# Altium schematic sheet Power.SchDoc
size A4; SheetNumber: 6; SheetTotal: 6
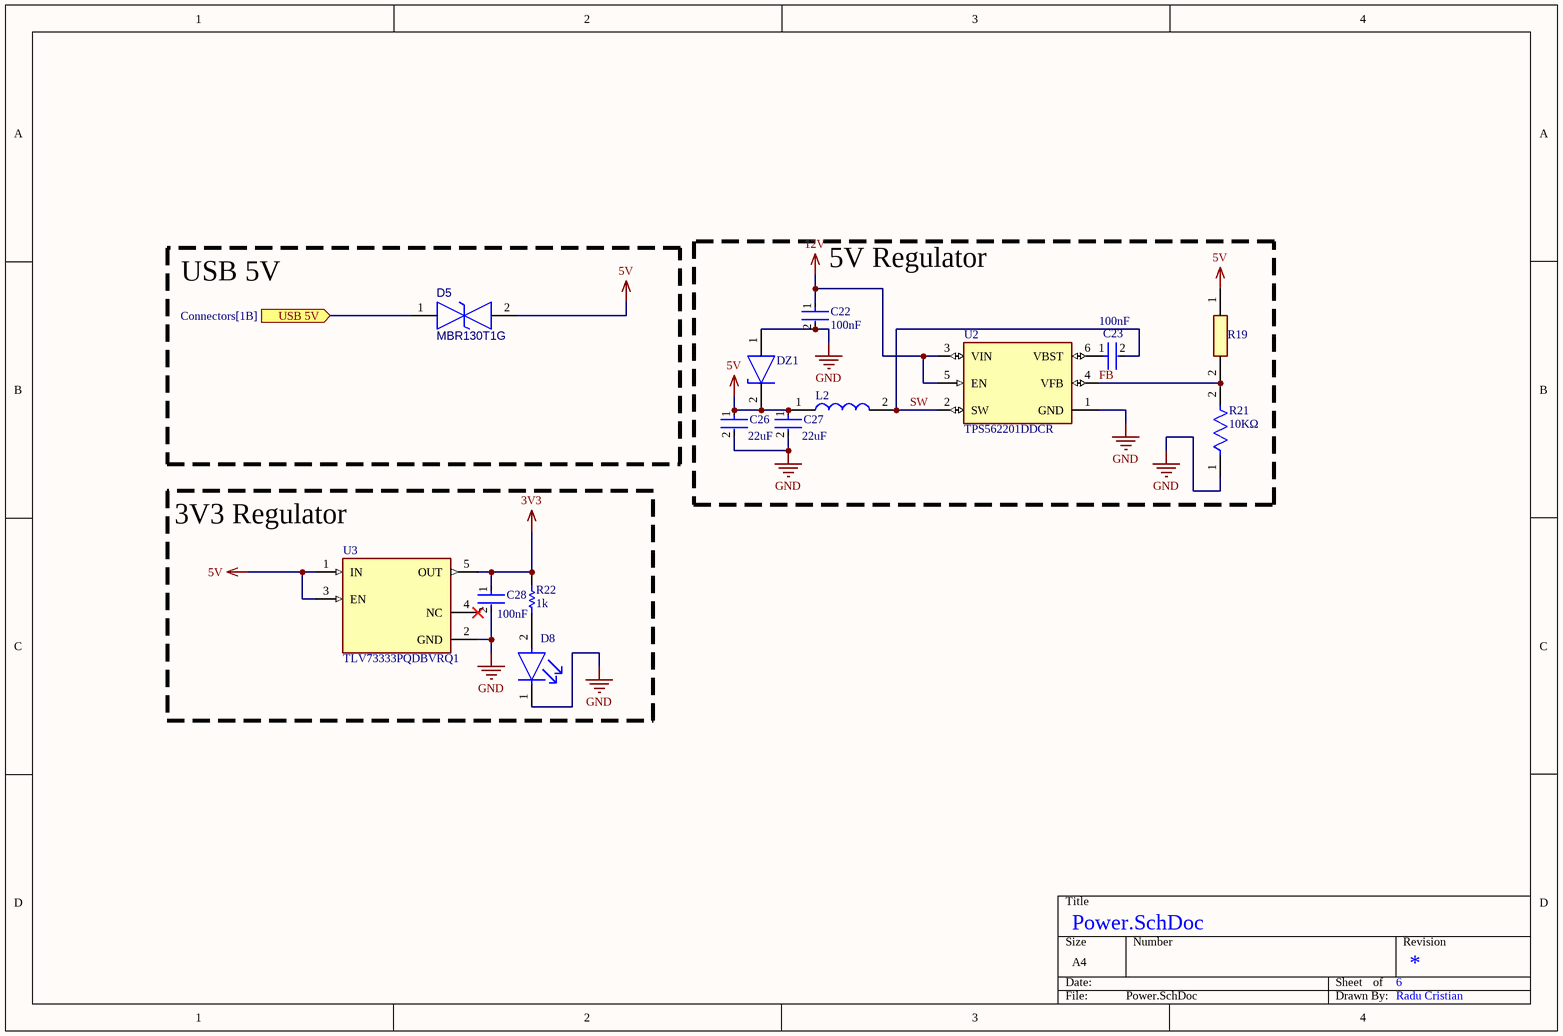
[diagram p0: Power.SchDoc]

## Parts
C22  Capacitance: 100nF  [FP-CC0603-DA-MFG]  (hidden comment: CC0603JRX7R9BB104)
C23  Capacitance: 100nF  [FP-CC0603-DA-MFG]  (hidden comment: CC0603JRX7R9BB104)
C26  Capacitance: 22uF  [FP-GRM188-0_2-IPC_C]  (hidden comment: GRM188R61A226ME15D)
C27  Capacitance: 22uF  [FP-GRM188-0_2-IPC_C]  (hidden comment: GRM188R61A226ME15D)
C28  Capacitance: 100nF  [FP-CC0603-DA-IPC_A]  (hidden comment: CC0603JRX7R9BB104)
D5  MBR130T1G  [ONSC-SOD-123-2-425-04_V]
D8  KPT-3216ID  [FP-APTD3216CGCK-MFG]  (value not drawn)
DZ1  VTVS5V0ASMF-M3-08  [FP-S8-V-3915_01-001-MFG]  (value not drawn)
L2  LCXHF3030QKT4R7MNR  [LCXHF3030QKT4R7MNR]  (value not drawn)
R19  ERA-3ARB563V  [ERA3AEB101V]  (value not drawn)
R21  Resistance: 10KΩ  [FP-CRGP0603-IPC_C]  (hidden comment: CRGP0603F10K)
R22  Parameter 1: 1k  [RESC2013X70X40ML20T20]  (hidden comment: ERJ-6ENF1001V)
U2  TPS562201DDCR  [FP-DDC0006A-IPC_C]
U3  TLV73333PQDBVRQ1  [FP-DBV0005A-IPC_A]

## Blocks framed on the sheet
5V Regulator: C22 C23 C26 C27 DZ1 L2 R19 R21 U2
USB 5V: D5
3V3 Regulator: C28 D8 R22 U3

## Ports
USB 5V (in, see Connectors[1B])

## Nets
3V3: C28.1 R22.1 U3.5(OUT)
5V: C26.1 C27.1 D5.2 DZ1.2(C) L2.1 R19.1 U3.1(IN) U3.3(EN)
12V: C22.1 U2.3(VIN) U2.5(EN)
GND: C22.2 C26.2 C27.2 C28.2 D8.1(C) DZ1.1(A) R21.1 U2.1(GND) U3.2(GND)
FB: R19.2 R21.2 U2.4(VFB)
SW: C23.2 L2.2 U2.2(SW)
USB 5V: D5.1 ; port USB 5V
NetC23_1: C23.1 U2.6(VBST)
NetD8_2: D8.2(A) R22.2

Not connected (* = marked no-connect by the designer): U3 4(NC)*

## Notes on the sheet
- Radu Cristian

## Library data of the parts
C22 C23 C28 = CMP-03422-001490-1: CAP CER 0.1UF 50V X7R 0603; Tolerance: 5%; Number of Pins: 2; Depth: 0.8mm; Weight: 7.1E-05oz; Radiation Hardening: No; Case Code (Metric): 1608; Dielectric: X7R; Max Operating Temperature: 125°C; Voltage Rating (DC): 50V; Case/Package: 0603; Halogen Free: Halogen Free; Mount: Surface Mount; Lead Free: Lead Free; Termination: SMD/SMT; RoHS Compliant: Yes; Length: 1.6mm; Series: CC; Resistor Type: Ceramic; Case Code (Imperial): 0603; Construction: Flat; Width: 0.031inch; Height: 0.8mm; Voltage Rating: 50V; Min Operating Temperature: -55°C; Thickness: 0.035inch; Packaging: Tape and Reel
C26 C27 = CMP-2000-06337-3: Chip Multilayer Ceramic Capacitors for General Purpose, 0603, 22uF, X5R, 15%, 20%, 10V; Tolerance: 20%; Weight: 0.000222oz; Material: Ceramic; Depth: 0.8mm; Length: 1.6mm; Termination: SMD/SMT; Packaging: Tape and Reel; Width: 0.8mm; Voltage Rating: 10V; Case Code (Imperial): 0603; Mount: Surface Mount; Voltage Rating (DC): 10V; Case/Package: 0603; Thickness: 0.039inch; REACH SVHC: No SVHC; Dielectric: X5R; Height: 0.8mm; Package Quantity: 4000; Case Code (Metric): 1608; Min Operating Temperature: -55°C; Lead Free: Lead Free; Max Operating Temperature: 85°C
D5 = CMP-00002-1: Rectifier Diode, Schottky, 1 Phase, 1 Element, 1A, 30V V(RRM), Silicon; Forward Voltage: 350mV; Number of Elements: 1; Additional Feature: FREE WHEELING DIODE; Package Body Material: Plastic; Qualification Status: Not Qualified; Time @ Peak Reflow Temperature-Max (s): 40s; Non-rep Pk Forward Current-Max: 5.5A; Pins: 2; Technology: SCHOTTKY; Diode Type: RECTIFIER; RoHS Compliant: Yes; Max Output current: 1A; Min Operating Temperature: -65°C; Package Shape: Rectangular; Package Style: SMALL OUTLINEMeter; Rep Pk Reverse Voltage-Max: 30V; Moisture Sensitivity Level: 1; Terminal Finish: Tin; Terminal Position: DUAL; Peak Reflow Temperature (Cel): 260°C; Reach SVHC Compliant: Yes; Max Operating Temperature: 125°C; JESD-30 Code: R-PDSO-G2; Surface Mount: Yes; Diode Element Material: SILICON; JESD-609 Code: e3; Terminal Form: Gull Wing
D8 = CMP-2000-05792-2: LED RED CLEAR 2SMD; Forward Voltage: 2.1V; Forward Current: 20mA; Luminous Intensity: 300mcd; Number of LEDs: 1; Dominant Wavelength: 570nm; Illumination Color: Green; Viewing Angle: 50°; Lead Free: Lead Free; Lens Color: Clear; Mount: Surface Mount; Package Quantity: 2000; Height: 1.8mm; Number of Pins: 2; Test Current: 20mA; Case Code (Metric): 3216; Case/Package: 1206; Case Code (Imperial): 1206; Color: Green; Width: 1.6mm; Packaging: Tape and Reel; Min Operating Temperature: -40°C; Lens Style: Clear; Max Operating Temperature: 85°C; Length: 3.2mm
DZ1 = CMP-00030-74204661-1: VTVS5V0ASMF-M3-08 Esd Protection Diode Smf Do219Ab5%; 5V; ir5 A; ip43A; p400W; cd2095Pf; Breakdown Voltage: 6.4V; RoHS: Non-Compliant; Schedule B: 8541100080, 8541100080; NexarPartId: 74204661; Packaging: Cut Tape
L2 = LCXHF3030QKT4R7MNR: Inductor; Manufacturer_Name: TAIYO YUDEN; Datasheet Link: https://ds.yuden.co.jp/TYCOMPAS/ap/specSheet?pn=LCXHF3030QKT4R7MNR; Height: 1.5mm; Manufacturer_Part_Number: LCXHF3030QKT4R7MNR
R19 = ERA-3ARB563V: Resistor; Manufacturer_Name: Panasonic; Datasheet Link: https://industrial.panasonic.com/cdbs/www-data/pdf/RDM0000/AOA0000C307.pdf; Height: 0.55mm; Manufacturer_Part_Number: ERA-3ARB563V; Mouser Part Number: 667-ERA-3ARB563V; Mouser Price/Stock: https://www.mouser.co.uk/ProductDetail/Panasonic/ERA-3ARB563V?qs=ob%252BdNz2%252BYEjUxBvjNQsa6g%3D%3D
R21 = CMP-03211-004414-1: CRGP 0603 10K 1%; Manufacturer: TE; Voltage Rating: 50V; Power Rating: 0.25W; Value: 10KΩ; Tolerance: 0.01; Temperature Coefficient: ±100ppm/°C; Octopart: https://octopart.com/crgp0603f10k-te+connectivity-91018721; Temperature Range Low: -55°C; Temperature Range High: +155°C; Device Class L3: Chip SMD Resistors; Package: CRGP0603; Height: 0.55mm; Series: CRGP; RoHS: TRUE; Composition: Thick Film; Digikey Description: CRGP 0603 10K 1%; Ipc Land Pattern Name: RESC16080X45; Mouser Description: Res, 10K, 1%, 0.25W, 0603, Thick Film; ComponentLink2Description: Datasheet; ComponentLink2URL: https://www.te.com/commerce/DocumentDelivery/DDEController?Action=srchrtrv&DocNm=9-1773463-9&DocType=DS&DocLang=English; Manufacturer Part Number: CRGP0603F10K; Temperature: -55°C to +155°C; Device Class L1: Passive Components; Lead Free: Yes; Ambient Temperature Range High: +70°C; Device Class L2: Resistors; Automotive: No; Category: Res
R22 = CMP-2001-04375-5: Chip Resistor, 1 KOhm, +/- 1%, 0.125 W, -55 to 155 degC, 0805 (2012 Metric), RoHS, Tape and Reel; Manufacturer: Panasonic; Voltage Rating: 150 V; ComponentLink1URL: http://www.panasonic.com/; ComponentLink2Description: Datasheet; REACH SVHC: Yes; ComponentLink1Description: Manufacturer URL; Length: 2 mm; Height: 0.6 mm; Package Quantity: 1; PackageDescription: 2-Pin Surface Mount Device, Body 2 x 1.25 mm; Packaging: Cut Tape; PackageReference: 0805; Max Operating Temperature: 155 degC; Mounting Technology: Surface Mount; ComponentLink2URL: http://industrial.panasonic.com/cdbs/www-data/pdf/RDA0000/AOA0000C86.pdf; DatasheetVersion: 04/2015; Min Operating Temperature: -55 degC; RoHSCompliant: true; Mount: Surface Mount
U2 = CMP-04918-000361-1: IC REG BUCK ADJ 2A TSOT23-6; Switching Frequency: 580kHz; Max Input Voltage: 17V; Number of Outputs: 1; Output Voltage: 7V; Output Type: Adjustable; Quiescent Current: 400uA; Min Input Voltage: 4.5V; Mount: Surface Mount; Max Operating Temperature: 125°C; Lead Free: Lead Free; Operating Supply Voltage: 17V; Number of Pins: 6; RoHS Compliant: Yes; Contact Plating: Tin; Min Operating Temperature: -40°C; Case/Package: SOT; Max Output Current: 2A
U3 = CMP-04917-000347-1: IC REG LINEAR 3.3V 300MA SOT23-5; RoHS Compliant: Yes